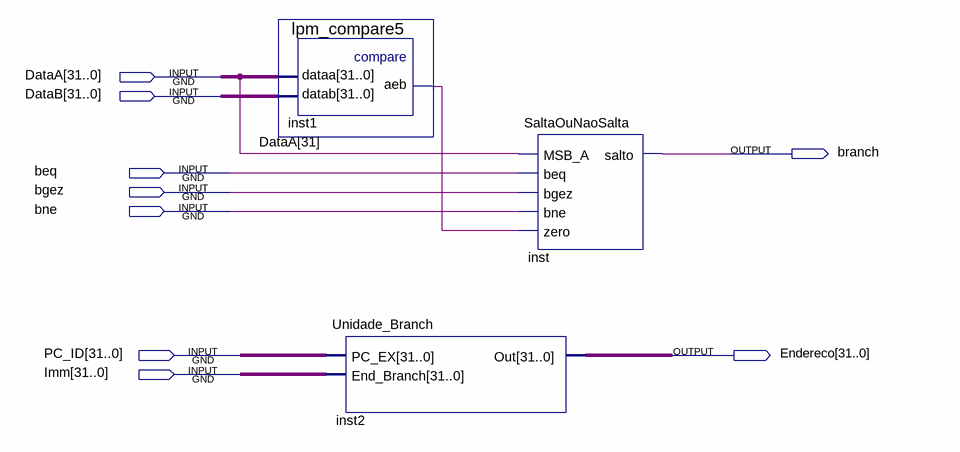
[diagram p0: schematic sheet]
// Quartus schematic Adianta_Branch.bdf as structural Verilog: 3 symbols, 9 pins
module Adianta_Branch (
  input  [31:0] DataA,
  input  [31:0] DataB,
  input  beq,
  input  bgez,
  input  bne,
  input  [31:0] PC_ID,
  input  [31:0] Imm,
  output branch,
  output [31:0] Endereco
);

  wire inst1_aeb;

  lpm_compare5 inst1 (.dataa(DataA), .datab(DataB), .aeb(inst1_aeb));
  Unidade_Branch inst2 (.PC_EX(PC_ID), .End_Branch(Imm), .Out(Endereco));
  SaltaOuNaoSalta inst (.MSB_A(DataA[31]), .beq(beq), .bgez(bgez), .bne(bne), .zero(inst1_aeb), .salto(branch));
endmodule
